# Altium project breakout_board_M4.PrjPcb
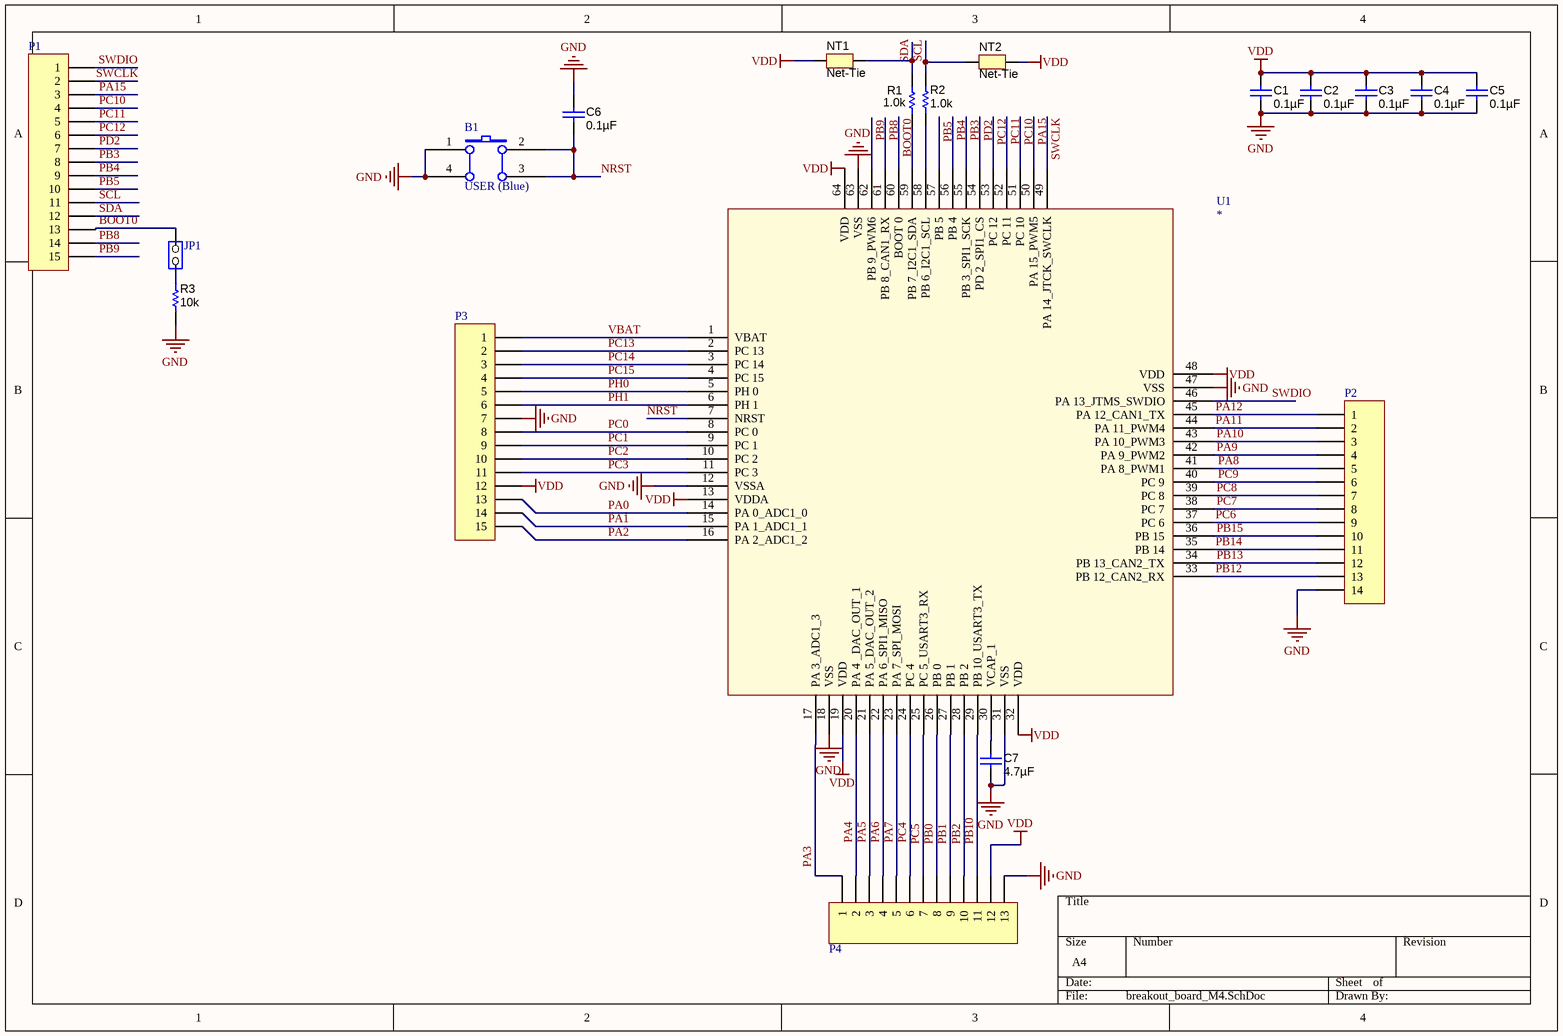
[diagram p0: breakout_board_M4.SchDoc]
1 sheet, 19 parts. Net scope: global (net labels, ports and power ports of the same name join across sheets).

## Sheet breakout_board_M4.SchDoc
size A4

### Parts
B1  USER (Blue)  [PB-6X6mm-Blue]
C1  ValueDisplayed: 0.1µF  [0603L]  (hidden comment: C0603C104K8RACTU)
C2  ValueDisplayed: 0.1µF  [0603L]  (hidden comment: C0603C104K8RACTU)
C3  ValueDisplayed: 0.1µF  [0603L]  (hidden comment: C0603C104K8RACTU)
C4  ValueDisplayed: 0.1µF  [0603L]  (hidden comment: C0603C104K8RACTU)
C5  ValueDisplayed: 0.1µF  [0603L]  (hidden comment: C0603C104K8RACTU)
C6  ValueDisplayed: 0.1µF  [0603L]  (hidden comment: C0603C104K8RACTU)
C7  ValueDisplayed: 4.7µF  [0805L]  (hidden comment: GRM21BR71A475KA73L)
JP1  (no value)  [HDR_1x2_2R54_V_M_S]
NT1  Net-Tie  [Net-Tie_10mil]  (net tie, no BOM)
NT2  Net-Tie  [Net-Tie_10mil]  (net tie, no BOM)
P1  (no value)  [HDR1X15]
P2  (no value)  [HDR1X14]
P3  (no value)  [HDR1X15]
P4  (no value)  [HDR1X13]
R1  value 1.0k  [0603L]  (hidden comment: CRCW06031K00JNEA)
R2  value 1.0k  [0603L]  (hidden comment: CRCW06031K00JNEA)
R3  value 10k  [0603L]  (hidden comment: CRCW060310K0JNEA)
U1  *  [LQFP64-10x10mm]

### Nets
GND: B1.1(A0) B1.4(A1) C1.2 C2.2 C3.2 C4.2 C5.2 C6.1 C7.1 P2.14 P3.7 P4.13 R3.1 U1.12(VSSA) U1.18(VSS) U1.31(VSS) U1.47(VSS) U1.63(VSS)
VDD: C1.1 C2.1 C3.1 C4.1 C5.1 NT1.1 NT2.2 P3.12 P4.12 U1.13(VDDA) U1.19(VDD) U1.32(VDD) U1.48(VDD) U1.64(VDD)
BOOT0: JP1.1(COMMON) P1.13 U1.60(BOOT_0)
NRST: B1.2(B0) B1.3(B1) C6.2 U1.7(NRST)
PA0: P3.13 U1.14(PA_0_ADC1_0)
PA1: P3.14 U1.15(PA_1_ADC1_1)
PA2: P3.15 U1.16(PA_2_ADC1_2)
PA3: P4.1 U1.17(PA_3_ADC1_3)
PA4: P4.2 U1.20(PA_4__DAC_OUT_1)
PA5: P4.3 U1.21(PA_5_DAC_OUT_2)
PA6: P4.4 U1.22(PA_6_SPI1_MISO)
PA7: P4.5 U1.23(PA_7_SPI_MOSI)
PA8: P2.5 U1.41(PA_8_PWM1)
PA9: P2.4 U1.42(PA_9_PWM2)
PA10: P2.3 U1.43(PA_10_PWM3)
PA11: P2.2 U1.44(PA_11_PWM4)
PA12: P2.1 U1.45(PA_12_CAN1_TX)
PA15: P1.3 U1.50(PA_15_PWM5)
PB0: P4.8 U1.26(PB_0)
PB1: P4.9 U1.27(PB_1)
PB2: P4.10 U1.28(PB_2)
PB3: P1.8 U1.55(PB_3_SPI1_SCK)
PB4: P1.9 U1.56(PB_4)
PB5: P1.10 U1.57(PB_5)
PB8: P1.14 U1.61(PB_8_CAN1_RX)
PB9: P1.15 U1.62(PB_9_PWM6)
PB10: P4.11 U1.29(PB_10_USART3_TX)
PB12: P2.13 U1.33(PB_12_CAN2_RX)
PB13: P2.12 U1.34(PB_13_CAN2_TX)
PB14: P2.11 U1.35(PB_14)
PB15: P2.10 U1.36(PB_15)
PC0: P3.8 U1.8(PC_0)
PC1: P3.9 U1.9(PC_1)
PC2: P3.10 U1.10(PC_2)
PC3: P3.11 U1.11(PC_3)
PC4: P4.6 U1.24(PC_4)
PC5: P4.7 U1.25(PC_5_USART3_RX)
PC6: P2.9 U1.37(PC_6)
PC7: P2.8 U1.38(PC_7)
PC8: P2.7 U1.39(PC_8)
PC9: P2.6 U1.40(PC_9)
PC10: P1.4 U1.51(PC_10)
PC11: P1.5 U1.52(PC_11)
PC12: P1.6 U1.53(PC_12)
PC13: P3.2 U1.2(PC_13)
PC14: P3.3 U1.3(PC_14)
PC15: P3.4 U1.4(PC_15)
PD2: P1.7 U1.54(PD_2_SPI1_CS)
PH0: P3.5 U1.5(PH_0)
PH1: P3.6 U1.6(PH_1)
SCL: NT2.1 P1.11 R2.2
SDA: NT1.2 P1.12 R1.2
SWCLK: P1.2 U1.49(PA_14_JTCK_SWCLK)
SWDIO: P1.1 U1.46(PA_13_JTMS_SWDIO)
VBAT: P3.1 U1.1(VBAT)
NetC7_2: C7.2 U1.30(VCAP_1)
NetJP1_2: JP1.2(NO) R3.2
NetR1_1: R1.1 U1.59(PB_7_I2C1_SDA)
NetR2_1: R2.1 U1.58(PB_6_I2C1_SCL)

### Library data of the parts
B1 = SW PUSHBUTTON: SE PUSHBUTTON
C1-C6 = C0603C104K8RACTU: CAP, CERM, 0.1 µF, 10 V, +/- 10%, X7R, 0603; Manufacturer: Kemet; Polarized: N; CompType: Capacitor; Value: 0.1uF; U/M: EA; Cap_F: 0.0000001; Tolerance_%: 10; Value1: Unknown; Value2: 10V; TaMin_C: -55; TaMax_C: 125; Cap_Case: 0603; AEC Category: Q200; SymbolVersion: 2008-07-09; PartNumber: C0603C104K8RACTU; PackageReference: 0603; RoHS: Y; VDC_V: 10; MountType: SMT; Technology: Ceramic; TempCo: X7R; Published: 2008-06-19; Publisher: Texas Instruments; LatestRevisionDate: 2015-12-04; ComponentLink1Description: Datasheet link; ComponentLink1URL: http://www.kemet.com/kemet/web/homepage/kechome.nsf/vapubfiles/F3102_Y5V.pdf/$file/F3102_Y5V.pdf; Supplier 1: Digi-Key; Supplier Part Number 1: 399-1095-1-ND; Supplier 2: Mouser; Supplier Part Number 2: 80-C0603C104K8R; Supplier 3: Farnell; Supplier Part Number 3: 1640032; AEC Qualified: ?
C7 = GRM21BR71A475KA73L: CAP, CERM, 4.7 µF, 10 V, +/- 10%, X7R, 0805; Manufacturer: MuRata; Polarized: N; CompType: Capacitor; Value: 4.7uF; U/M: EA; Cap_F: 0.0000047; Tolerance_%: 10; Value1: Unknown; Value2: 10V; TaMin_C: -55; TaMax_C: 125; Cap_Case: 0805; AEC Category: Q200; SymbolVersion: 2008-07-09; PartNumber: GRM21BR71A475KA73L; PackageReference: 0805; RoHS: Y; VDC_V: 10; MountType: SMT; Technology: Ceramic; TempCo: X7R; Published: 2008-06-19; Publisher: Texas Instruments; LatestRevisionDate: 2015-12-04; ComponentLink1Description: Datasheet link; ComponentLink1URL: http://search.murata.co.jp/Ceramy/PnsearchViewAction.do?HnOFG=ON&HnNFG=ON&SEL_CNT=50&sLang=en&sKey=GRM21BR71A475KA73L&x=9&y=9&search=startwith; Supplier 1: Digi-Key; Supplier Part Number 1: GRM21BR71A475KA73L-ND; Supplier 2: Mouser; Supplier Part Number 2: 81-GRM21BR71A475KA73; Supplier 3: Farnell; Supplier Part Number 3: 1845769; AEC Qualified: ?
JP1 = JP2
NT1 NT2 = Net-Tie: Single point connection between nets.; SymbolCreator: codlsc; SymbolVersion: 2009-07-01; MountType: SMT; Publisher: Texas Instruments; LatestRevisionDate: 2015-10-18; LatestRevisionNote: Added Alternate PartNumber and Alternate Manufacturer parameters to appropriate components.; PackageReference: N/A
P1 P3 = Header 15: Header, 15-Pin; LatestRevisionDate: 17-Jul-2002; LatestRevisionNote: Re-released for DXP Platform.; Publisher: Altium Limited
P2 = Header 14: Header, 14-Pin; LatestRevisionDate: 17-Jul-2002; LatestRevisionNote: Re-released for DXP Platform.; Publisher: Altium Limited
P4 = Header 13: Header, 13-Pin; LatestRevisionDate: 17-Jul-2002; LatestRevisionNote: Re-released for DXP Platform.; Publisher: Altium Limited
R1 R2 = CRCW06031K00JNEA: RES, 1.0 k, 5%, 0.1 W, 0603; Manufacturer: Vishay-Dale; CompType: Resistor; Res_ohm: 1000; Value_Code: 1k00; Tolerance_%: 5; Power_W: 0.1; Value2: 0.1W; VDC_V: 75; TempCo: 200 ppm/C; EIA_Code: E24; U/M: EA; AEC Category: Q200; SymbolVersion: 2009-05-29; PartNumber: CRCW06031K00JNEA; PackageReference: 0603; RoHS: Y; Value1: 5%; MountType: SMT; Technology: Thick Film; Published: 2008-06-26; Publisher: Texas Instruments; LatestRevisionDate: 2015-11-22; ComponentLink1Description: Datasheet link; ComponentLink1URL: http://www.vishay.com/docs/20035/dcrcwe3.pdf; Supplier 1: Digi-Key; Supplier Part Number 1: 541-1.0KGCT-ND; Supplier 2: Mouser; Supplier Part Number 2: 71-CRCW0603J-1.0K-E3; Supplier 3: Farnell; Supplier Part Number 3: 1652851; ValueDisplayed: 1.0k; AEC Qualified: ?
R3 = CRCW060310K0JNEA: RES, 10 k, 5%, 0.1 W, 0603; Manufacturer: Vishay-Dale; CompType: Resistor; Res_ohm: 10000; Value_Code: 10k0; Tolerance_%: 5; Power_W: 0.1; Value2: 0.1W; VDC_V: 75; TempCo: 200 ppm/C; EIA_Code: E24; U/M: EA; AEC Category: Q200; SymbolVersion: 2009-05-29; PartNumber: CRCW060310K0JNEA; PackageReference: 0603; RoHS: Y; Value1: 5%; MountType: SMT; Technology: Thick Film; Published: 2008-06-26; Publisher: Texas Instruments; LatestRevisionDate: 2015-11-22; ComponentLink1Description: Datasheet link; ComponentLink1URL: http://www.vishay.com/docs/20035/dcrcwe3.pdf; Supplier 1: Digi-Key; Supplier Part Number 1: 541-10KGCT-ND; Supplier 2: Mouser; Supplier Part Number 2: 71-CRCW0603J-10K-E3; Supplier 3: Farnell; Supplier Part Number 3: 1469749; ValueDisplayed: 10k; AEC Qualified: ?
U1 = STM32F446RE